# Altium schematic sheet Pixracer_V1_FMU_Alternative_1.SchDoc
size 431 x 179 mm; Origin: Eagle
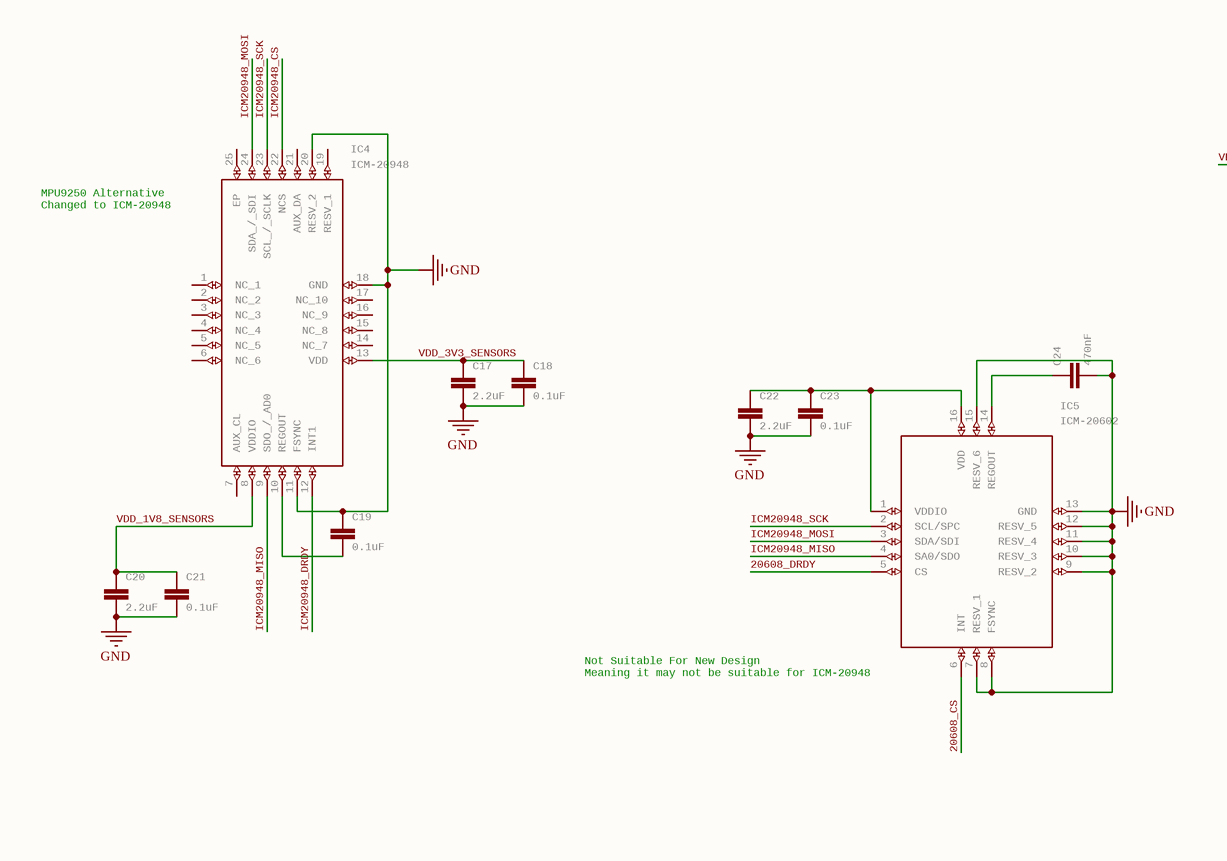
[diagram p0: Pixracer_V1_FMU_Alternative_1.SchDoc, left]
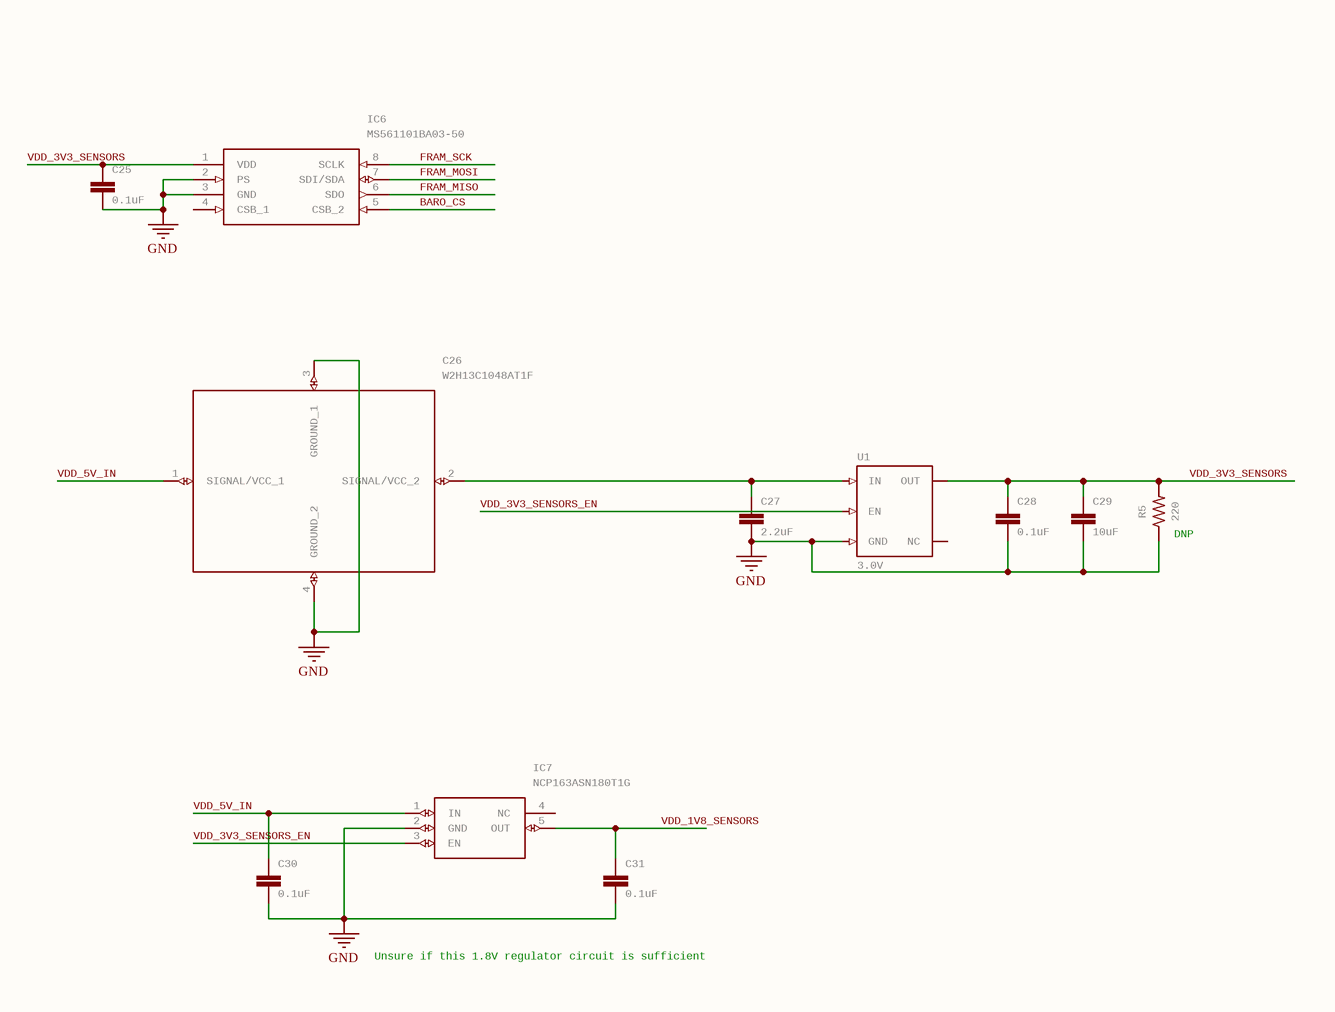
[diagram p1: Pixracer_V1_FMU_Alternative_1.SchDoc, right]

## Parts
C17  2.2uF  [1206]
C18  0.1uF  [0603]
C19  0.1uF  [0603]
C20  2.2uF  [1206]
C21  0.1uF  [0603]
C22  2.2uF  [1206]
C23  0.1uF  [0603]
C24  470nF  [0603]
C25  0.1uF  [0603]
C26  W2H13C1048AT1F  [W2H13C1048AT1A]
C27  2.2uF  [1206]
C28  0.1uF  [0603]
C29  10uF  [1206]
C30  0.1uF  [0603]
C31  0.1uF  [0603]
IC4  ICM-20948  [QFN40P300X300X105-25N]
IC5  ICM-20602  [IAM20680HP]
IC6  MS561101BA03-50  [MS561101BA03-50]
IC7  NCP163ASN180T1G  [SOT95P280X145-5N]
R5  220  [0603]
U1  3.0V  [SOT23-5]

## Nets
GND: C17.2 C18.2 C19.1 C20.2 C21.2 C22.2 C23.2 C24.2 C25.2 C26.3(GROUND_1) C26.4(GROUND_2) C27.2 C28.2 C29.2 C30.2 C31.2 IC4.11(FSYNC) IC4.18(GND) IC4.20(RESV_2) IC5.7(RESV_1) IC5.8(FSYNC) IC5.9(RESV_2) IC5.10(RESV_3) IC5.11(RESV_4) IC5.12(RESV_5) IC5.13(GND) IC5.15(RESV_6) IC6.2(PS) IC6.3(GND) IC7.2(GND) R5.1 U1.2(GND)
20608_CS: IC5.6(INT)
20608_DRDY: IC5.5(CS)
BARO_CS: IC6.5(CSB_2)
FRAM_MISO: IC6.6(SDO)
FRAM_MOSI: IC6.7(SDI/SDA)
FRAM_SCK: IC6.8(SCLK)
ICM20948_CS: IC4.22(NCS)
ICM20948_DRDY: IC4.12(INT1)
ICM20948_MISO: IC4.9(SDO_/_AD0) IC5.4(SA0/SDO)
ICM20948_MOSI: IC4.24(SDA_/_SDI) IC5.3(SDA/SDI)
ICM20948_SCK: IC4.23(SCL_/_SCLK) IC5.2(SCL/SPC)
VDD_1V8_SENSORS: C20.1 C21.1 C31.1 IC4.8(VDDIO) IC7.5(OUT)
VDD_3V3_SENSORS: C17.1 C18.1 C25.1 C28.1 C29.1 IC4.13(VDD) IC6.1(VDD) R5.2 U1.5(OUT)
VDD_3V3_SENSORS_EN: IC7.3(EN) U1.3(EN)
VDD_5V_IN: C26.1(SIGNAL/VCC_1) C30.1 IC7.1(IN)
NetC19_2: C19.2 IC4.10(REGOUT)
NetC22_1: C22.1 C23.1 IC5.1(VDDIO) IC5.16(VDD)
NetC24_1: C24.1 IC5.14(REGOUT)
NetC26_2: C26.2(SIGNAL/VCC_2) C27.1 U1.1(IN)

Not connected (* = marked no-connect by the designer): IC4 1(NC_1) 2(NC_2) 3(NC_3) 4(NC_4) 5(NC_5) 6(NC_6) 7(AUX_CL) 14(NC_7) 15(NC_8) 16(NC_9) 17(NC_10) 19(RESV_1) 21(AUX_DA) 25(EP); IC6 4(CSB_1); IC7 4(NC); U1 4(NC)

## Notes on the sheet
- (near IC4) MPU9250 Alternative
  Changed to ICM-20948
- (near R5) DNP
- (near IC5) Not Suitable For New Design
  Meaning it may not be suitable for ICM-20948
- Unsure if this 1.8V regulator circuit is sufficient

## Library data of the parts
C17 C20 C22 C27 = 2.2UF-1206-50V-10%: 2.2ÂµF ceramic capacitors    A capacitor is a passive two-terminal electrical component used to store electrical energy temporarily in an electric field.; GateName_1: G$1; SymbolName_1: CAP; PROD_ID: CAP-10009; DeviceName: -1206-50V-10%; LibraryName: SparkFun-Capacitors; DeviceSetName: 2.2UF
C18 C19 C21 C23 C25 C28 C30 C31 = 0.1UF-0603-100V-10%-X7R-WE: 0.1ÂµF ceramic capacitors    A capacitor is a passive two-terminal electrical component used to store electrical energy temporarily in an electric field.; GateName_1: G$1; SymbolName_1: CAP; PROD_ID: CAP-16436; DeviceName: -0603-100V-10%-X7R-WE; LibraryName: SparkFun-Capacitors; DeviceSetName: 0.1UF
C24 = 470NF-0603-10V-10%-X5R: 0.47uF/470nF ceramic capacitors    A capacitor is a passive two-terminal electrical component used to store electrical energy temporarily in an electric field.; GateName_1: G$1; SymbolName_1: CAP; PROD_ID: CAP-13216; DeviceName: -0603-10V-10%-X5R; LibraryName: SparkFun-Capacitors; DeviceSetName: 470NF
C26 = W2H13C1048AT1F: Feed Through Capacitors 25volt 0.1uF X7R   Source:  Datasheet; MANUFACTURER_NAME: AVX; GateName_1: G$1; SymbolName_1: W2H13C1048AT1F; LibraryName: SamacSys_Parts; DeviceSetName: W2H13C1048AT1F; DESCRIPTION: Feed Through Capacitors 25volt 0.1uF X7R; HEIGHT: 1mm; MANUFACTURER_PART_NUMBER: W2H13C1048AT1F; MOUSER_PART_NUMBER: 581-W2H13C1048AT1F; MOUSER_PRICE-STOCK: https://www.mouser.com/Search/Refine.aspx?Keyword=581-W2H13C1048AT1F
C29 = 10UF-1206-6.3V-20%: 10.0ÂµF ceramic capacitors    A capacitor is a passive two-terminal electrical component used to store electrical energy temporarily in an electric field.; GateName_1: G$1; SymbolName_1: CAP; PROD_ID: CAP-10057; DeviceName: -1206-6.3V-20%; LibraryName: SparkFun-Capacitors; DeviceSetName: 10UF
IC4 = ICM-20948: IMUs - Inertial Measurement Units World's Lowest Power 9-Axis MEMS MotionTracking Device   Source:  Datasheet; MANUFACTURER_NAME: TDK; GateName_1: G$1; SymbolName_1: ICM-20948; LibraryName: SamacSys_Parts; DeviceSetName: ICM-20948; DESCRIPTION: IMUs - Inertial Measurement Units World's Lowest Power 9-Axis MEMS MotionTracking Device; HEIGHT: 1.05mm; MANUFACTURER_PART_NUMBER: ICM-20948; MOUSER_PART_NUMBER: 410-ICM-20948; MOUSER_PRICE-STOCK: https://www.mouser.co.uk/ProductDetail/TDK-InvenSense/ICM-20948?qs=u4fy%2FsgLU9OtGc31yF%2Friw%3D%3D
IC5 = ICM-20602: IMUs - Inertial Measurement Units Low-Power, High-Performance Integrated 6-Axis MEMS MotionTracking  Device in 3mm x 3mm Package   Source:  Datasheet; MANUFACTURER_NAME: TDK; GateName_1: G$1; SymbolName_1: ICM-20602; LibraryName: SamacSys_Parts; DeviceSetName: ICM-20602; DESCRIPTION: IMUs - Inertial Measurement Units Low-Power, High-Performance Integrated 6-Axis MEMS MotionTracking  Device in 3mm x 3mm Package; HEIGHT: mm; MANUFACTURER_PART_NUMBER: ICM-20602; MOUSER_PART_NUMBER: 410-ICM-20602; MOUSER_PRICE-STOCK: https://www.mouser.co.uk/ProductDetail/TDK-InvenSense/ICM-20602?qs=u4fy%2FsgLU9NtDChFbqTxBA%3D%3D
IC6 = MS561101BA03-50: Sensor Pressure 1.2bar Barometric SMD MS561101BA03-50, Barometric Pressure Sensor, 1200mbar 0  3.6 V Output, 8-Pin QFN   Source:  Datasheet; MANUFACTURER_NAME: TE Connectivity; GateName_1: G$1; SymbolName_1: MS561101BA03-50; LibraryName: SamacSys_Parts; DeviceSetName: MS561101BA03-50; DESCRIPTION: Sensor Pressure 1.2bar Barometric SMD MS561101BA03-50, Barometric Pressure Sensor, 1200mbar 0  3.6 V Output, 8-Pin QFN; HEIGHT: mm; MANUFACTURER_PART_NUMBER: MS561101BA03-50; MOUSER_PART_NUMBER: 824-MS561101BA03-50; MOUSER_PRICE-STOCK: https://www.mouser.co.uk/ProductDetail/Measurement-Specialties/MS561101BA03-50?qs=%252BgKeJhng5iV%252BnCz6Qd5iDw%3D%3D
IC7 = NCP163ASN180T1G: LDO Voltage Regulators LDO Reg, Ultra-Low Noise High PSRR 1.8V   Source:  Datasheet; MANUFACTURER_NAME: onsemi; GateName_1: G$1; SymbolName_1: NCP163ASN180T1G; LibraryName: SamacSys_Parts; DeviceSetName: NCP163ASN180T1G; DESCRIPTION: LDO Voltage Regulators LDO Reg, Ultra-Low Noise High PSRR 1.8V; HEIGHT: 1.45mm; MANUFACTURER_PART_NUMBER: NCP163ASN180T1G; MOUSER_PART_NUMBER: 863-NCP163ASN180T1G; MOUSER_PRICE-STOCK: https://www.mouser.co.uk/ProductDetail/onsemi/NCP163ASN180T1G?qs=vLWxofP3U2z0o2tJM%252BNAYw%3D%3D
R5 = 220OHM-0603-1/10W-1%: 220Î© resistor    A resistor is a passive two-terminal electrical component that implements electrical resistance as a circuit element. Resistors act to reduce current flow, and, at the same time, act to lower voltage levels within circuits. - Wikipedia; GateName_1: G$1; DeviceSetName: 220OHM; PROD_ID: RES-07861; SymbolName_1: RESISTOR; DeviceName: -0603-1/10W-1%; LibraryName: SparkFun-Resistors
U1 = V_REG_LP5907SOT23-3.0V: LP5907 - 250mA Ultra-Low-Noise LDO Regulator w/ Enable    The LP5907 is a low-noise LDO that can supply up to 250 mA output current. Designed to meet the requirements of RF and analog circuits, the LP5907 device provides low noise, high PSRR, low quiescent current, and low line or load transient response figures. Using new innovative design techniques, the LP5907 offers class-leading noise performance without a noise bypass capacitor and the ability for remote output capacitor placement. The device is designed to work with a 1-ÂµF input and a 1-ÂµF output ceramic capacitor (no separate noise bypass capacitor is required). This device is available with fixed output voltages from 1.2 V to 4.5 V in 25-mV steps.; MANU_PART: LP5907MFX-3.0/NOPB; GateName_1: G$1; SymbolName_1: V-REG-LDO_NO-BP; PROD_ID: VREG-15586; DeviceName: SOT23-3.0V; LibraryName: SparkFun-IC-Power; DeviceSetName: V_REG_LP5907; DIGIKEY_PART: 296-40357-1-ND; MOUSER_PART: 595-LP5907MFX-3.0NPB; PACKAGE: SOT-23(5)